# Altium schematic sheet Mcontr_0.SchDoc
size 420 x 297 mm; ApprovedBy: Гришин; CheckedBy: Недвецкий; Author: Буй; Address1: Address1; Address2: Address2; Address3: Address3; Address4: Address4; DocumentNumber: ИМ 1301.10A.01.400 Э3; SheetNumber: 4; SheetTotal: 4; Scale: 1:1; Letter1Column: Э
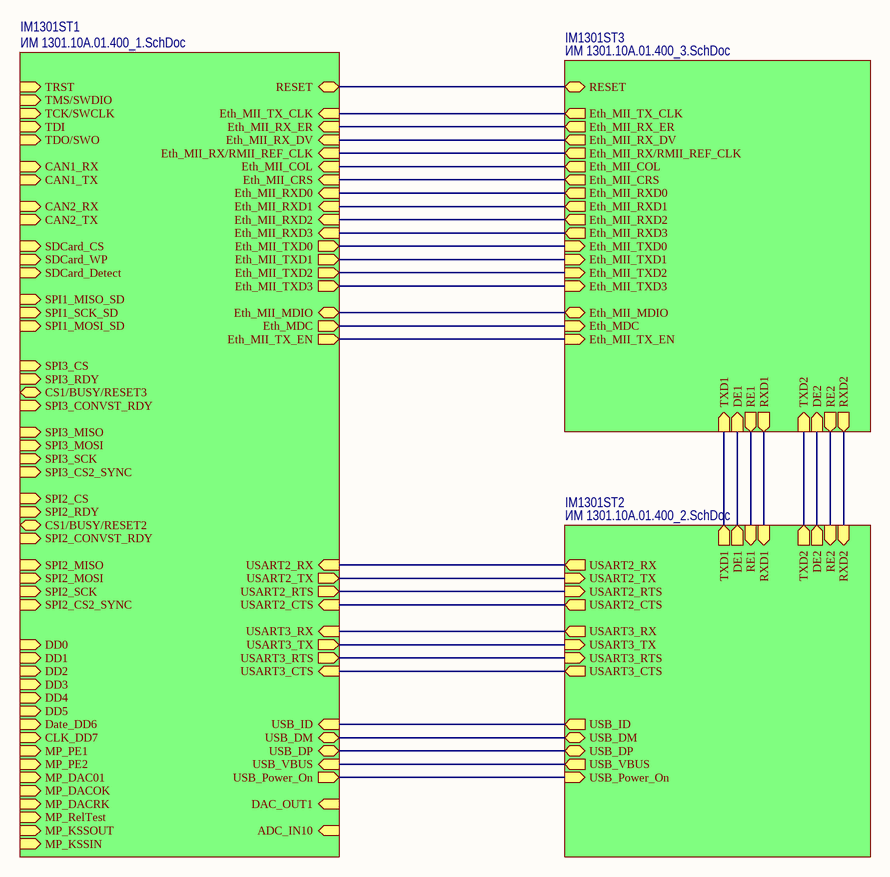
[diagram p0: Mcontr_0.SchDoc]

## Sub-sheets
IM1301ST1 = ИМ 1301.10A.01.400_1.SchDoc: TRST (in), TMS/SWDIO (in), TCK/SWCLK (in), TDI (in), TDO/SWO (in), RESET (bidir), USART2_RX (in), USART2_TX (out), USART2_RTS (out), USART2_CTS (in), CAN1_RX (in), CAN1_TX (in), USART3_TX (out), USART3_RX (in), USART3_CTS (in), USART3_RTS (out), SDCard_Detect (in), SPI1_MISO_SD (in), USB_VBUS (in), USB_ID (in), USB_DM (bidir), USB_DP (bidir), Eth_MII_CRS (in), Eth_MII_RX/RMII_REF_CLK (in), Eth_MII_MDIO (bidir), Eth_MII_RX_ER (in), Eth_MII_TX_EN (out), Eth_MII_TXD0 (out), Eth_MII_TXD3 (out), Eth_MDC (out), Eth_MII_TXD2 (out), Eth_MII_TX_CLK (in), USB_Power_On (out), SPI3_MISO (in), Eth_MII_RXD2 (in), Eth_MII_RXD3 (in), Eth_MII_RXD0 (in), Eth_MII_RXD1 (in), DAC_OUT1 (in), ADC_IN10 (in), CAN2_RX (in), CAN2_TX (in), SPI3_SCK (in), SPI3_MOSI (in), SPI3_CS2_SYNC (in), SPI3_CONVST_RDY (in), CS1/BUSY/RESET3 (bidir), SPI3_CS (in), SPI3_RDY (in), MP_KSSIN (in), Date_DD6 (in), MP_PE1 (in), MP_PE2 (in), MP_DAC01 (in), MP_DACOK (in), MP_DACRK (in), MP_RelTest (in), MP_KSSOUT (in), Eth_MII_RX_DV (in), SPI2_MISO (in), Eth_MII_TXD1 (out), SPI2_MOSI (in), SPI2_SCK (in), SPI2_CS2_SYNC (in), SPI2_CONVST_RDY (in), SPI2_CS (in), SPI2_RDY (in), CS1/BUSY/RESET2 (bidir), DD0 (in), DD1 (in), DD2 (in), DD3 (in), DD4 (in), DD5 (in), CLK_DD7 (in), SPI1_SCK_SD (in), SPI1_MOSI_SD (in), SDCard_CS (in), Eth_MII_COL (in), SDCard_WP (in)
IM1301ST2 = ИМ 1301.10A.01.400_2.SchDoc: USART3_TX (in), USART3_RX (out), USART3_CTS (out), USART3_RTS (in), USB_DM (bidir), USB_DP (bidir), USB_ID (out), USB_Power_On (in), USB_VBUS (out), TXD1 (out), RXD1 (in), DE1 (out), RE1 (in), USART2_RX (out), USART2_TX (in), USART2_RTS (in), USART2_CTS (out), TXD2 (out), RXD2 (in), DE2 (out), RE2 (in)
IM1301ST3 = ИМ 1301.10A.01.400_3.SchDoc: Eth_MII_CRS (out), Eth_MII_MDIO (bidir), Eth_MII_COL (out), Eth_MII_RXD2 (out), Eth_MII_RXD3 (out), Eth_MDC (in), Eth_MII_TXD2 (in), Eth_MII_TX_CLK (out), Eth_MII_RXD0 (out), Eth_MII_RXD1 (out), Eth_MII_RX_ER (out), Eth_MII_TX_EN (in), Eth_MII_TXD0 (in), Eth_MII_TXD1 (in), Eth_MII_TXD3 (in), Eth_MII_RX_DV (out), Eth_MII_RX/RMII_REF_CLK (out), RESET (bidir), TXD1 (in), RXD1 (out), DE1 (in), RE1 (out), TXD2 (in), RXD2 (out), DE2 (in), RE2 (out)

## Nets
(unnamed): sheet IM1301ST1/RESET, sheet IM1301ST3/RESET
(unnamed): sheet IM1301ST1/USART2_RX, sheet IM1301ST2/USART2_RX
(unnamed): sheet IM1301ST1/USART2_TX, sheet IM1301ST2/USART2_TX
(unnamed): sheet IM1301ST1/USART2_RTS, sheet IM1301ST2/USART2_RTS
(unnamed): sheet IM1301ST1/USART2_CTS, sheet IM1301ST2/USART2_CTS
(unnamed): sheet IM1301ST1/USART3_TX, sheet IM1301ST2/USART3_TX
(unnamed): sheet IM1301ST1/USART3_RX, sheet IM1301ST2/USART3_RX
(unnamed): sheet IM1301ST1/USART3_CTS, sheet IM1301ST2/USART3_CTS
(unnamed): sheet IM1301ST1/USART3_RTS, sheet IM1301ST2/USART3_RTS
(unnamed): sheet IM1301ST1/USB_VBUS, sheet IM1301ST2/USB_VBUS
(unnamed): sheet IM1301ST1/USB_ID, sheet IM1301ST2/USB_ID
(unnamed): sheet IM1301ST1/USB_DM, sheet IM1301ST2/USB_DM
(unnamed): sheet IM1301ST1/USB_DP, sheet IM1301ST2/USB_DP
(unnamed): sheet IM1301ST1/Eth_MII_CRS, sheet IM1301ST3/Eth_MII_CRS
(unnamed): sheet IM1301ST1/Eth_MII_RX/RMII_REF_CLK, sheet IM1301ST3/Eth_MII_RX/RMII_REF_CLK
(unnamed): sheet IM1301ST1/Eth_MII_MDIO, sheet IM1301ST3/Eth_MII_MDIO
(unnamed): sheet IM1301ST1/Eth_MII_RX_ER, sheet IM1301ST3/Eth_MII_RX_ER
(unnamed): sheet IM1301ST1/Eth_MII_TX_EN, sheet IM1301ST3/Eth_MII_TX_EN
(unnamed): sheet IM1301ST1/Eth_MII_TXD0, sheet IM1301ST3/Eth_MII_TXD0
(unnamed): sheet IM1301ST1/Eth_MII_TXD3, sheet IM1301ST3/Eth_MII_TXD3
(unnamed): sheet IM1301ST1/Eth_MDC, sheet IM1301ST3/Eth_MDC
(unnamed): sheet IM1301ST1/Eth_MII_TXD2, sheet IM1301ST3/Eth_MII_TXD2
(unnamed): sheet IM1301ST1/Eth_MII_TX_CLK, sheet IM1301ST3/Eth_MII_TX_CLK
(unnamed): sheet IM1301ST1/USB_Power_On, sheet IM1301ST2/USB_Power_On
(unnamed): sheet IM1301ST1/Eth_MII_RXD2, sheet IM1301ST3/Eth_MII_RXD2
(unnamed): sheet IM1301ST1/Eth_MII_RXD3, sheet IM1301ST3/Eth_MII_RXD3
(unnamed): sheet IM1301ST1/Eth_MII_RXD0, sheet IM1301ST3/Eth_MII_RXD0
(unnamed): sheet IM1301ST1/Eth_MII_RXD1, sheet IM1301ST3/Eth_MII_RXD1
(unnamed): sheet IM1301ST1/Eth_MII_RX_DV, sheet IM1301ST3/Eth_MII_RX_DV
(unnamed): sheet IM1301ST1/Eth_MII_TXD1, sheet IM1301ST3/Eth_MII_TXD1
(unnamed): sheet IM1301ST1/Eth_MII_COL, sheet IM1301ST3/Eth_MII_COL
(unnamed): sheet IM1301ST2/TXD1, sheet IM1301ST3/TXD1
(unnamed): sheet IM1301ST2/RXD1, sheet IM1301ST3/RXD1
(unnamed): sheet IM1301ST2/DE1, sheet IM1301ST3/DE1
(unnamed): sheet IM1301ST2/RE1, sheet IM1301ST3/RE1
(unnamed): sheet IM1301ST2/TXD2, sheet IM1301ST3/TXD2
(unnamed): sheet IM1301ST2/RXD2, sheet IM1301ST3/RXD2
(unnamed): sheet IM1301ST2/DE2, sheet IM1301ST3/DE2
(unnamed): sheet IM1301ST2/RE2, sheet IM1301ST3/RE2

## Notes on the sheet
- Подп. и дата
- Инв. № дубл.
- Взам. инв. №
- Инв. № подл.
- Изм.
- Лист
- № докум.
- Подп.
- Дата
- 2.106-A3
- Копировал
- Формат А3